# EAGLE design hal-sensor (EAGLE 9.2.2)
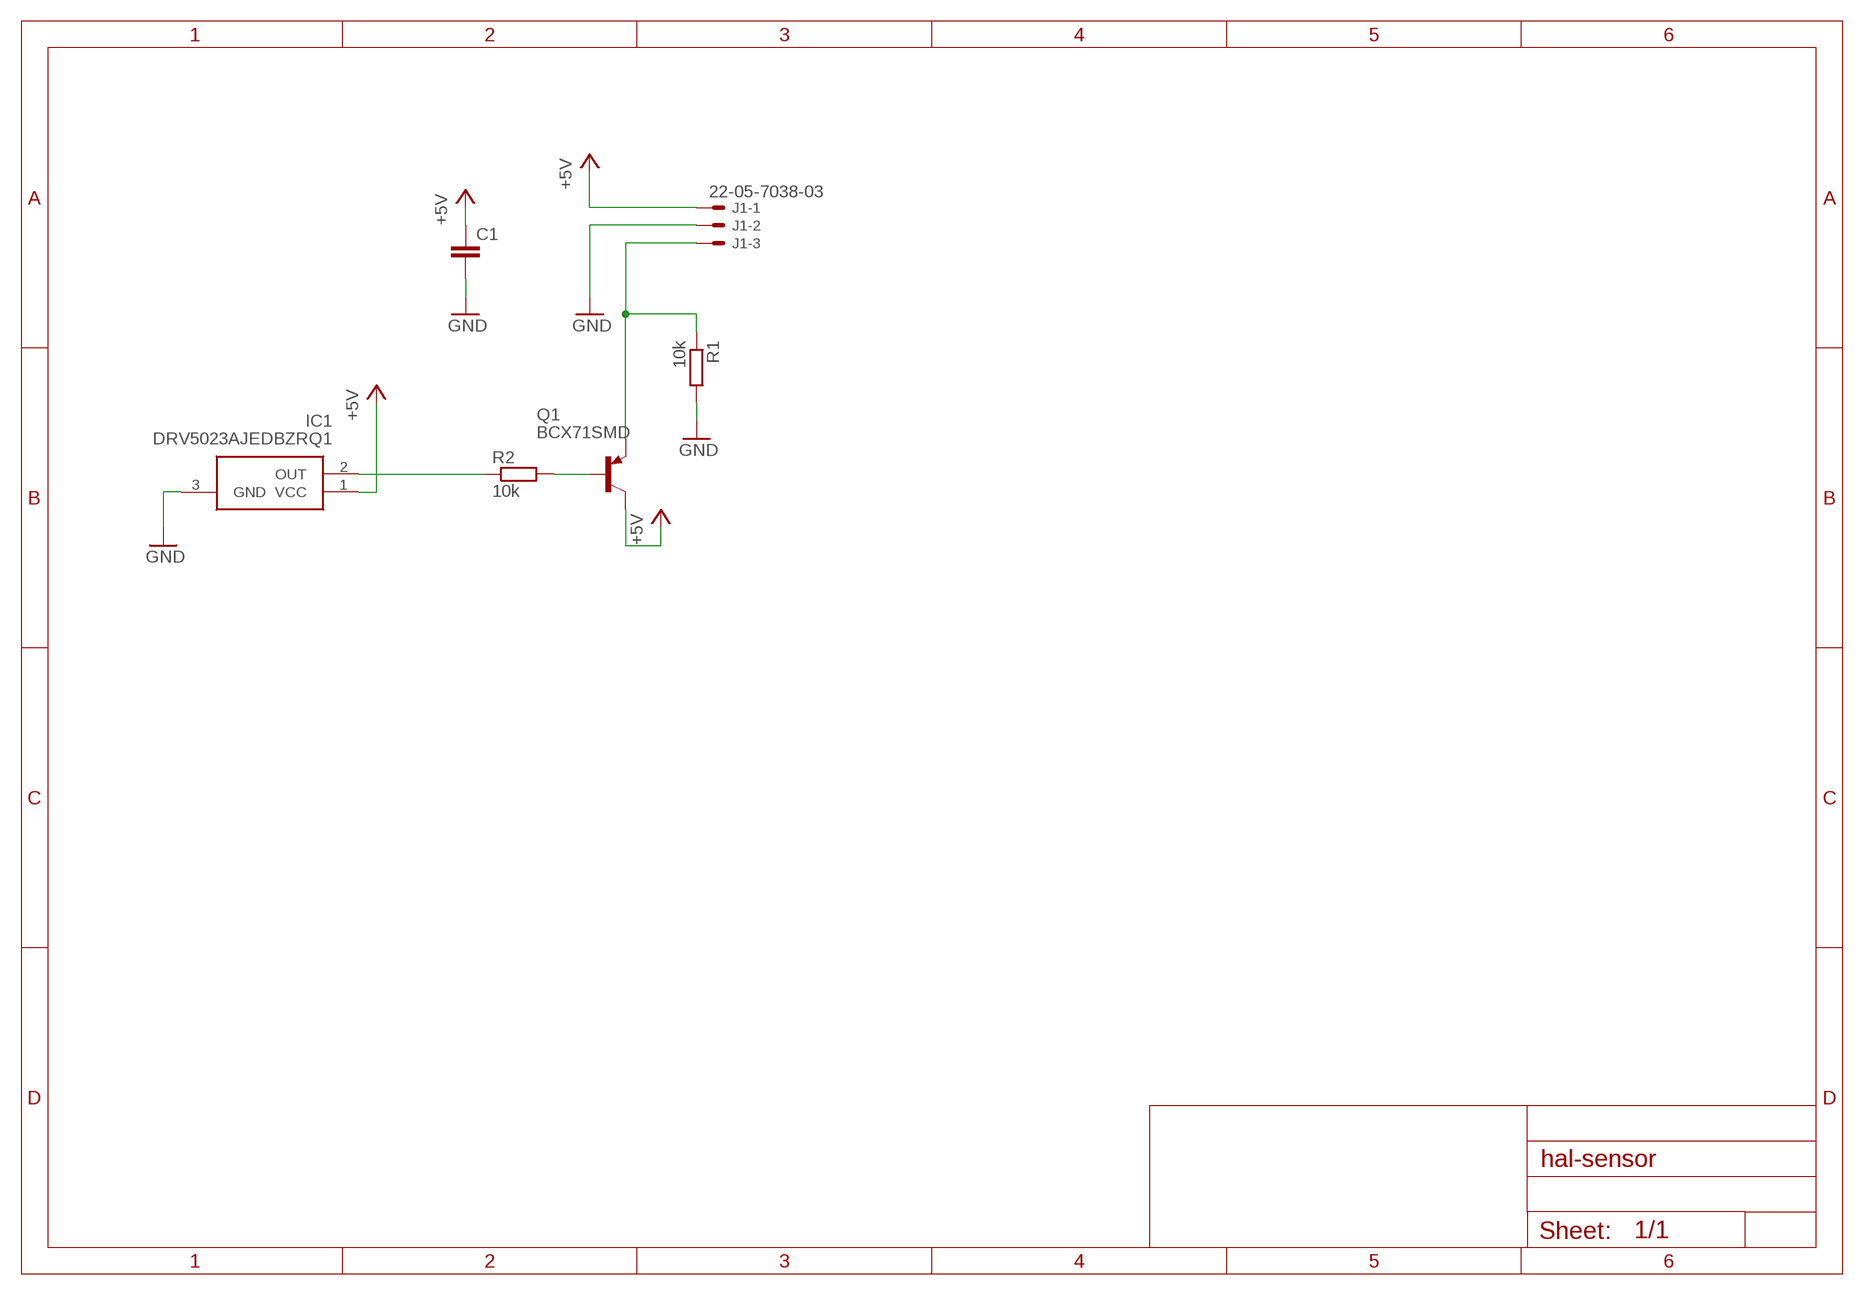
[diagram p0: schematic, sheet 1]

## Parts
C1  C-EUC0805  [C0805]
IC1  DRV5023AJEDBZRQ1  [SOT95P237X112-3N]
J1  22-05-7038-03  [7395-03]
Q1  BCX71SMD  [SOT23]
R1  10k  R-EU_R0805  [R0805]
R2  10k  R-EU_R0805  [R0805]

## Nets
+5V: C1.1 IC1.1(VCC) J1.1 Q1.3(C)
CTRL: J1.3 Q1.2(E) R1.1
GND: C1.2 IC1.3(GND) J1.2 R1.2
N$1: IC1.2(OUT) R2.1
N$3: Q1.1(B) R2.2

## Library data of the parts
C1 = resistor:C-EU: CAPACITOR, European symbol
IC1 = DRV5023AJEDBZRQ1:DRV5023AJEDBZRQ1: Automotive 2.7V to 38V Hall Effect Unipolar Switch Sensor Source: Datasheet <http://www.ti.com/lit/gpn/drv5023-q1>; DESCRIPTION: Automotive 2.7V to 38V Hall Effect Unipolar Switch Sensor; HEIGHT: 1.12mm; MANUFACTURER_NAME: Texas Instruments; MANUFACTURER_PART_NUMBER: DRV5023AJEDBZRQ1; MOUSER_PART_NUMBER: 595-DRV5023AJEDBZRQ1
J1 = con-molex:22-?-03: CONNECTOR wire to board 2.54 mm (.1 inch) pitch header; MF: MOLEX; OC_FARNELL: unknown; OC_NEWARK: unknown
Q1 = transistor-pnp:BCX71SMD: PNP Transistor
R1 R2 = resistor:R-EU_: RESISTOR, European symbol

## Board
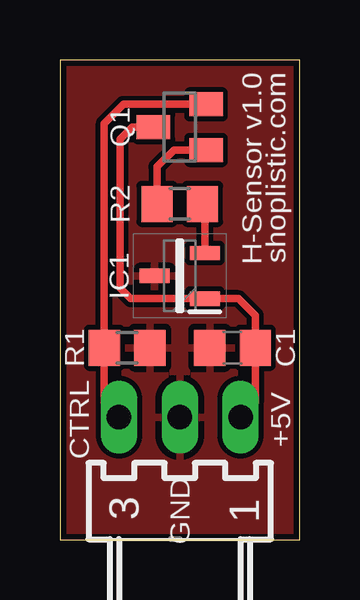
[diagram p1: board, top side]
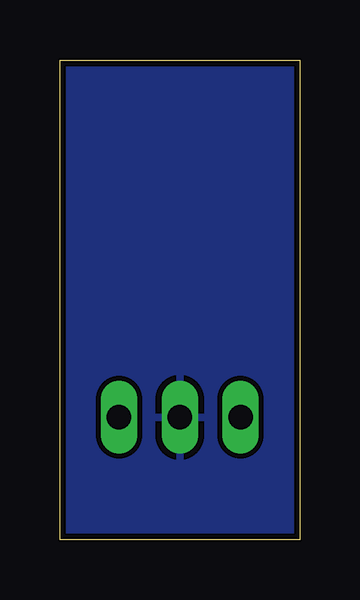
[diagram p2: board, bottom side, seen from below]

Size 10 x 20 mm. Coordinates in mm from the lower left corner, seen from the top.
Outline: 0,0 10,0 10,20 0,20 0,0
Copper layers (1*16): Top 0.035mm / dielectric 1.5mm / Bottom 0.035mm
Design rules "default *": minimum track width 6mil, minimum drill 0.35mm, track to track 8mil, track to pad 8mil, pad to pad 8mil, via to via 8mil, smd to smd 6mil, copper to edge 10mil, drill to drill 10mil, minimum pad ring 10mil, minimum via ring 8mil, stop-mask expansion 4mil, vias tented up to drill 0mil, thermal gap 10mil

### Footprints (pad centres in the part's own frame; a part is rotated, then mirrored left to right if it is on the bottom)
C0805 = smd 1.3 x 1.5: 1 -0.95,0; 2 0.95,0
SOT95P237X112-3N = smd 1.25 x 0.6: 1 -1.05,0.95; 2 -1.05,-0.95; 3 1.05,0
7395-03 = drill 1.016 long: 1 2.54,0; 2 0,0; 3 -2.54,0
SOT23 = smd 1 x 1.4: 1 -0.95,-1.1; 2 0.95,-1.1; 3 0,1.1
R0805 = smd 1.3 x 1.5: 1 -0.95,0; 2 0.95,0

### Placement (x,y rotation side)
C1  7.2,8 180 top
IC1  5,11 180 top
J1  5,5.1 0 top
Q1  5,17.2 90 top
R1  2.8,8 0 top
R2  5,14 180 top

### Tracks (layer width: path | path; a pad name or v marks a point on that pad's centre or on a via)
+5V
  Top 0.305: J1.1 8.15,5.71 C1.1 8.15,9.35 7.45,10.05 IC1.1 2.95,10.05 2.5,10.5 2.5,16.7 3,17.2 Q1.3
CTRL
  Top 0.305: Q1.2 2.65,18.15 1.85,17.35 R1.1 1.85,5.71 J1.3
GND
  pour Bottom: -1.35,20.78 -1.35,-1.77 11.35,-1.77 11.35,20.78
  pour Top: -1.5,20.5 11.5,20.5 11.5,-2 -1.5,-2
N$1
  Top 0.305: IC1.2 6.05,13.9 R2.1
N$3
  Top 0.305: Q1.1 4.75,16.25 4.05,15.55 R2.2

### Text on the board
tNames: H-Sensor v1.0 | shoplistic.com | CTRL | +5V | GND